# EAGLE design RectifierPart (EAGLE 9.6.2)
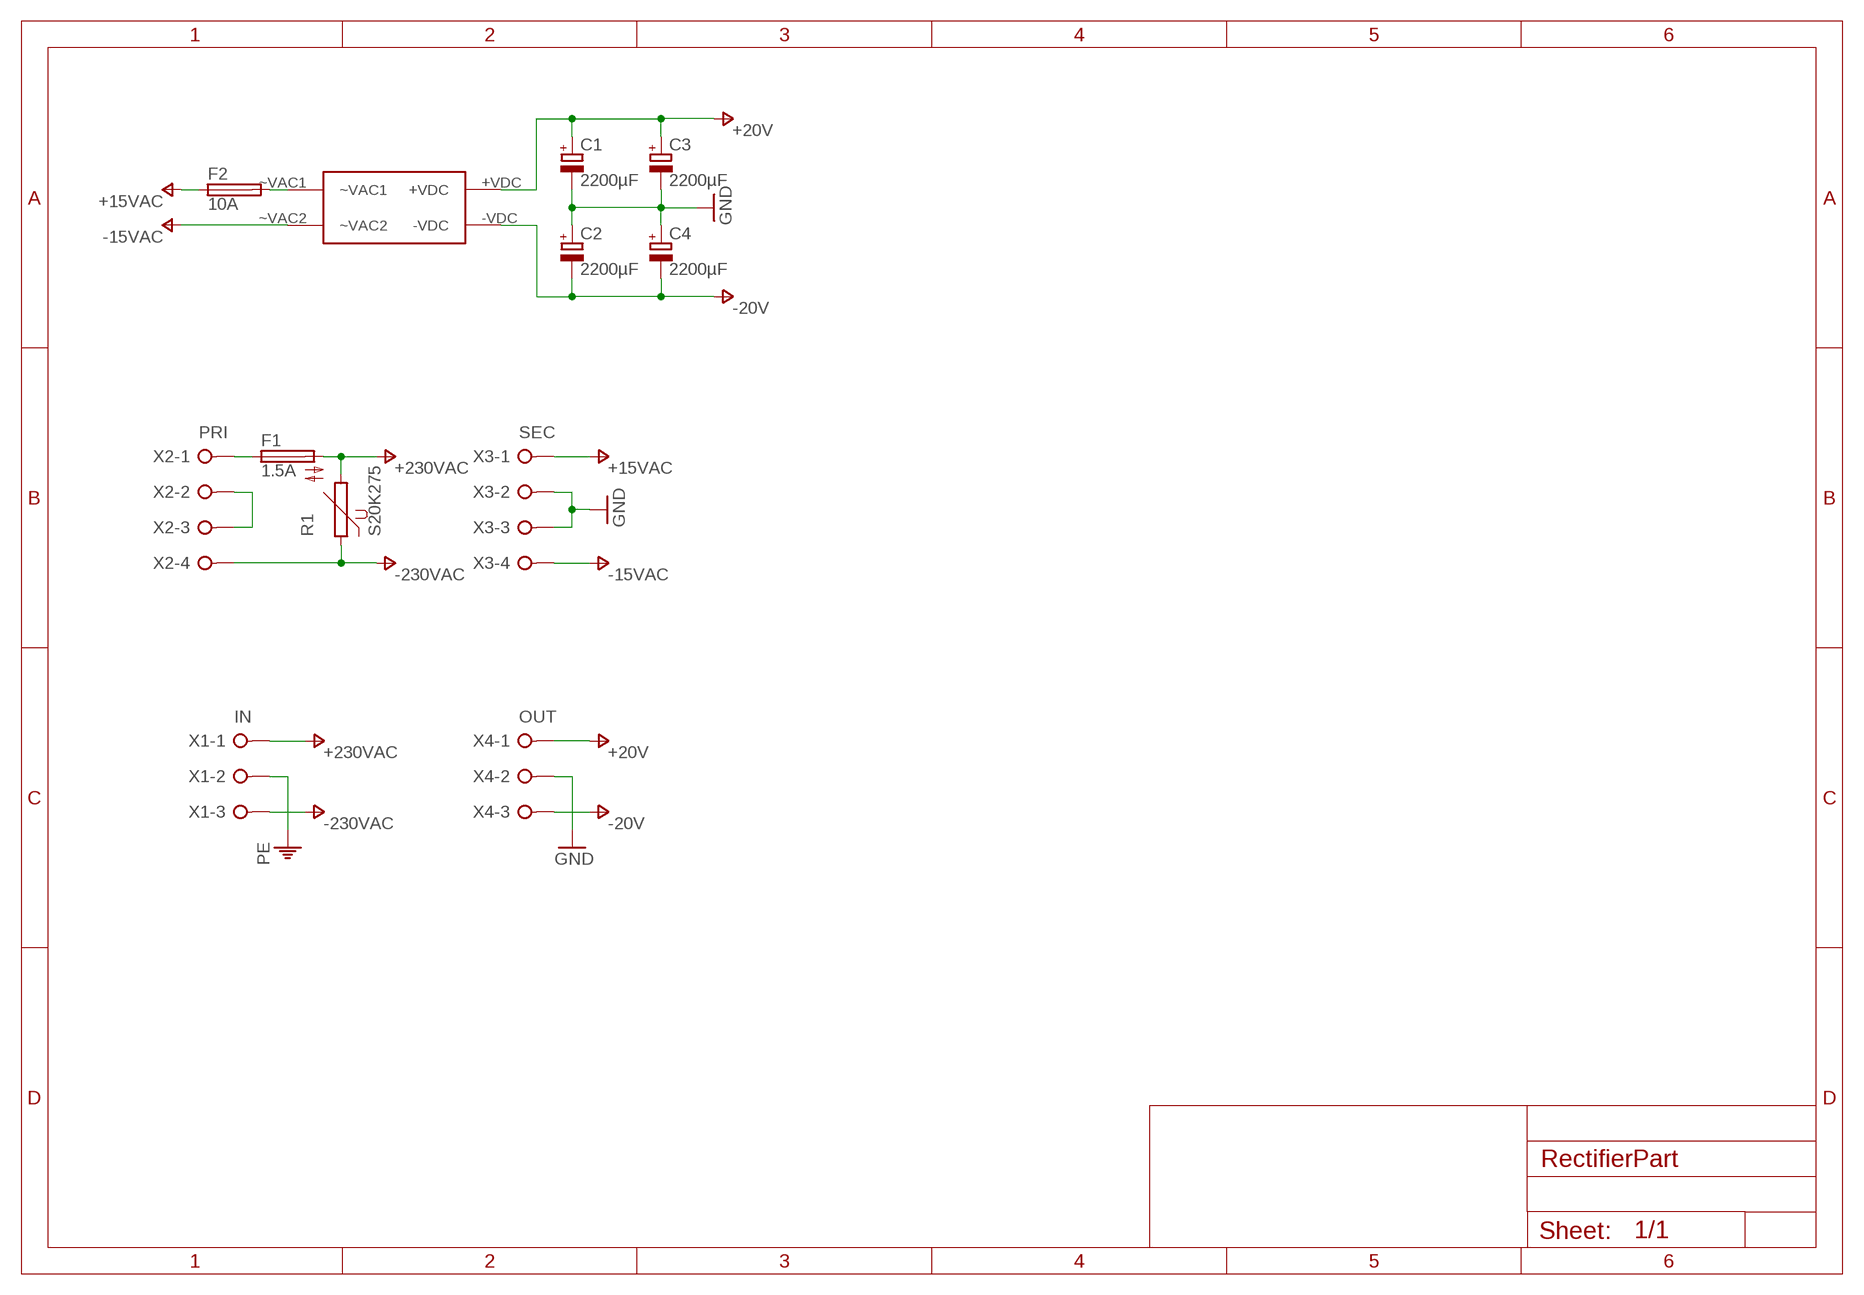
[diagram p0: schematic, sheet 1]

## Parts
C1  2200µF  CPOL-EUE7.5-16  [E7,5-16]
C2  2200µF  CPOL-EUE7.5-16  [E7,5-16]
C3  2200µF  CPOL-EUE7.5-16  [E7,5-16]
C4  2200µF  CPOL-EUE7.5-16  [E7,5-16]
F1  1.5A  SH22,5A  [SH22,5A]
F2  10A  SH22,5A  [SH22,5A]
R1  S20K275  [S20K275]
R+1  B40C5000-3300A  [B..C]
X1  IN  W237-03P  [W237-133]
X2  PRI  W237-04P  [W237-4P]
X3  SEC  W237-04P  [W237-4P]
X4  OUT  W237-03P  [W237-133]

## Nets
+15VAC: F2.1 X3.1
+20V: C1.+ C3.+ R+1.+VDC X4.1
+230VAC: F1.2 R1.2 X1.1
-15VAC: R+1.~VAC2 X3.4
-20V: C2.- C4.- R+1.-VDC X4.3
-230VAC: R1.1 X1.3 X2.4
GND: C1.- C2.+ C3.- C4.+ X3.2 X3.3 X4.2
N$1: F2.2 R+1.~VAC1
N$2: X2.2 X2.3
N$3: F1.1 X2.1
PE: X1.2

## Library data of the parts
C1-C4 = rcl:CPOL-EU: POLARIZED CAPACITOR, European symbol; SPICEPREFIX: C
F1 F2 = fuse:SH22,5A: FUSE HOLDER grid 22,5mm, isolated cap OGN0031 8201, Schurter (Buerklin); MPN: 0031.7701.11; OC_FARNELL: unknown; OC_NEWARK: 04F1224
R1 = varistor:S20K275: VARISTOR
R+1 = bb84:B40C5000-3300A: Allgemeines Ausführung: Silizium-Brückengleichrichter Bauform: Standard -WW+ Modell: B40C Elektrische Werte Eingangsspannung: 40VAC Nennstrom: 5A URRM: 80V Maße Breite: 32mm Höhe: 17mm Tiefe: 5,6mm Herstellerangaben Hersteller: DIOTEC Artikelnummer des Herstellers: B40C5000-3300A Verpackungsgewicht: 0.007kg RoHS: konform EAN/GTIN: 9900002169822
X1 X4 = con-wago-508:W237-03P: WAGO SREW CLAMP; OC_FARNELL: unknown; OC_NEWARK: unknown
X2 X3 = con-wago-508:W237-04P: WAGO SREW CLAMP; OC_FARNELL: unknown; OC_NEWARK: unknown

## Board
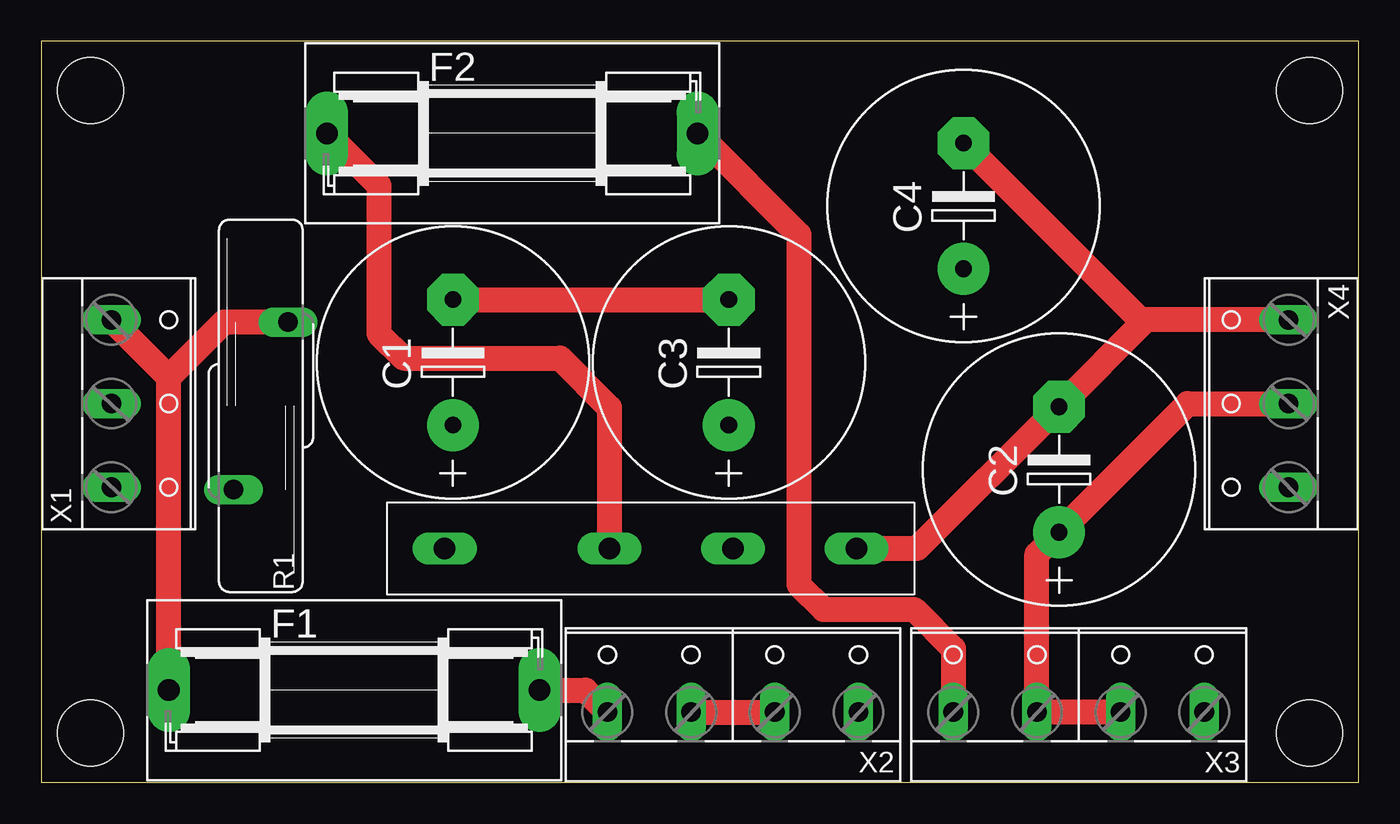
[diagram p1: board, top side]
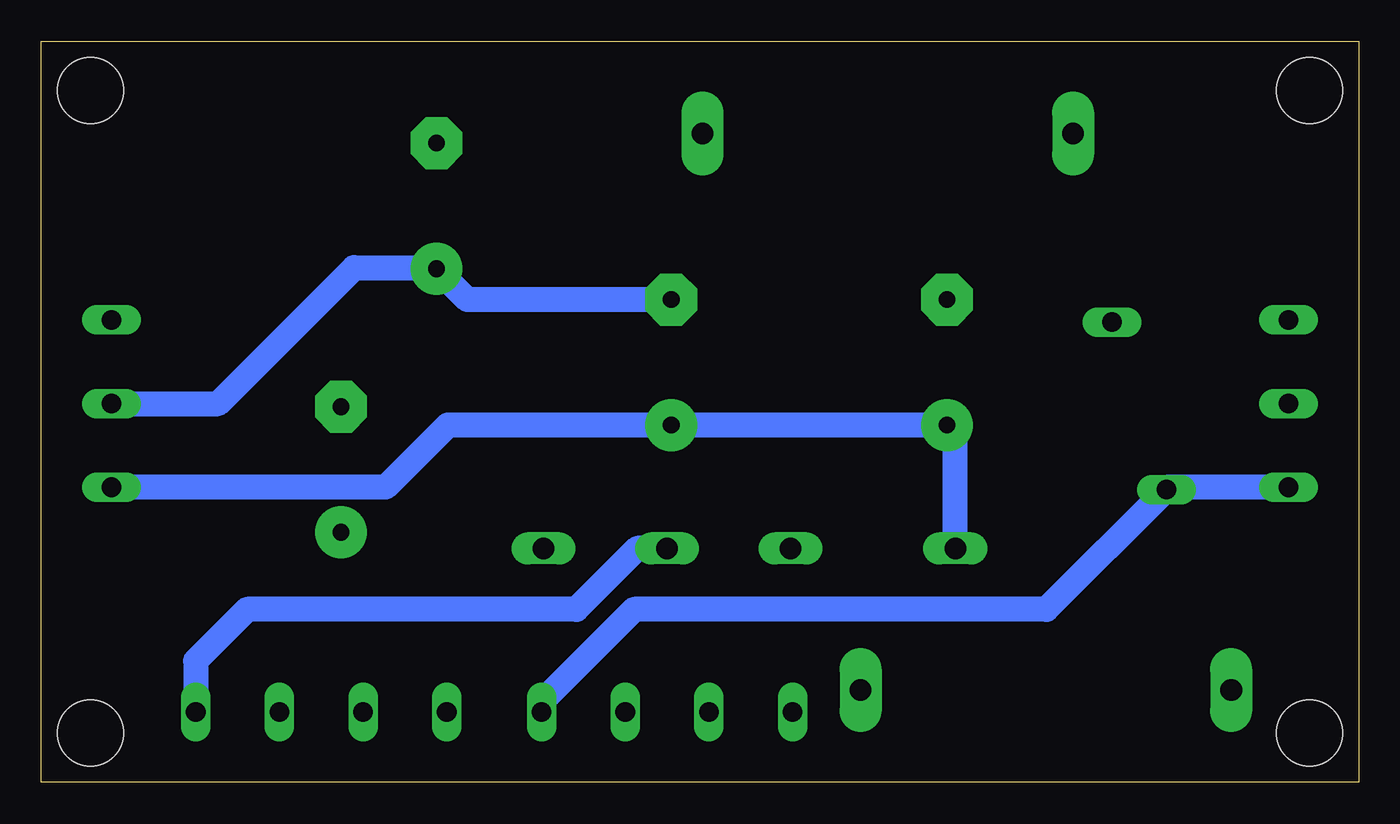
[diagram p2: board, bottom side, seen from below]

Size 80 x 45 mm. Coordinates in mm from the lower left corner, seen from the top.
Outline: 0,0 80,0 80,45 0,45 0,0
Copper layers (1*16): Top 0.035mm / dielectric 1.5mm / Bottom 0.035mm
Design rules "default *": minimum track width 50mil, minimum drill 0.5mm, track to track 6mil, track to pad 6mil, pad to pad 6mil, via to via 6mil, smd to smd 6mil, copper to edge 40mil, drill to drill 6mil, minimum pad ring 10mil, minimum via ring 8mil, stop-mask expansion 4mil, vias tented up to drill 0mil, thermal gap 10mil
Holes 4 mm at 3,3 77,3 77,42 3,42

### Footprints (pad centres in the part's own frame; a part is rotated, then mirrored left to right if it is on the bottom)
E7,5-16 = drill 1.016 pad 3.15: + -3.81,0 | drill 1.016 pad 3.15 octagon: - 3.81,0
SH22,5A = drill 1.321 pad 2.54 long: 1 -11.252,0; 2 11.252,0
S20K275 = drill 1.194 long: 1 -1.651,-5.08; 2 1.651,5.08
B..C = drill 1.3 long: +VDC 3.5,2.8; -VDC 28.5,2.8; ~VAC1 13.5,2.8; ~VAC2 21,2.8
W237-133 = drill 1.194 long: 1 -5.08,-0.635; 2 0,-0.635; 3 5.08,-0.635
W237-4P = drill 1.194 long: 1 -7.62,-0.635; 2 -2.54,-0.635; 3 2.54,-0.635; 4 7.62,-0.635

### Placement (x,y rotation side)
C1  25,25.5 90 top
C2  61.8,19 90 top
C3  41.75,25.5 90 top
C4  56,35 90 top
F1  19,5.6 180 top
F2  28.6,39.4 180 top
R1  13.34,22.86 0 top
R+1  21,11.4 0 top
X1  4.9,23 270 top
X2  42,4.9 0 top
X3  63,4.9 0 top
X4  75.1,23 90 top

### Tracks (layer width: path | path; a pad name or v marks a point on that pad's centre or on a via)
+15VAC
  Top 1.524: F2.1 46,33.25 46,12 47.5,10.5 53,10.5 55.38,8.12 X3.1
+20V
  Bottom 1.524: R+1.+VDC 24.5,21.19 C1.+ C3.+ 55.31,21.69 59.08,17.92 X4.1
+230VAC
  Top 1.524: F1.2 7.75,24.6 | 7.75,24.6 X1.1 | R1.2 11.09,27.94 7.75,24.6
-15VAC
  Bottom 1.524: R+1.~VAC2 43.8,14.2 47.5,10.5 67.5,10.5 70.62,7.38 X3.4
-20V
  Top 1.524: X4.3 67.07,28.08 | 67.07,28.08 C2.- 53.19,14.2 R+1.-VDC | C4.- 66.73,28.08 67.07,28.08
-230VAC
  Bottom 1.524: X1.3 11.54,17.92 R1.1 18.96,10.5 44,10.5 49.62,4.88 X2.4
GND
  Top 1.524: X3.3 X3.2 60.46,13.85 C2.+ 69.61,23 X4.2 | C1.- C3.-
  Bottom 1.524: C3.- 54.12,29.31 C4.+ 56.06,31.25 61,31.25 69.25,23 X4.2
N$1
  Top 1.524: F2.2 20.5,36.25 20.5,27.25 22,25.75 31.5,25.75 34.5,22.75 R+1.~VAC1
N$2
  Top 1.524: X2.2 X2.3
N$3
  Top 1.524: F1.1 33.05,5.6 X2.1